# EAGLE schematic 01-main (EAGLE 9.6.2)

## Sheet 1 of 3
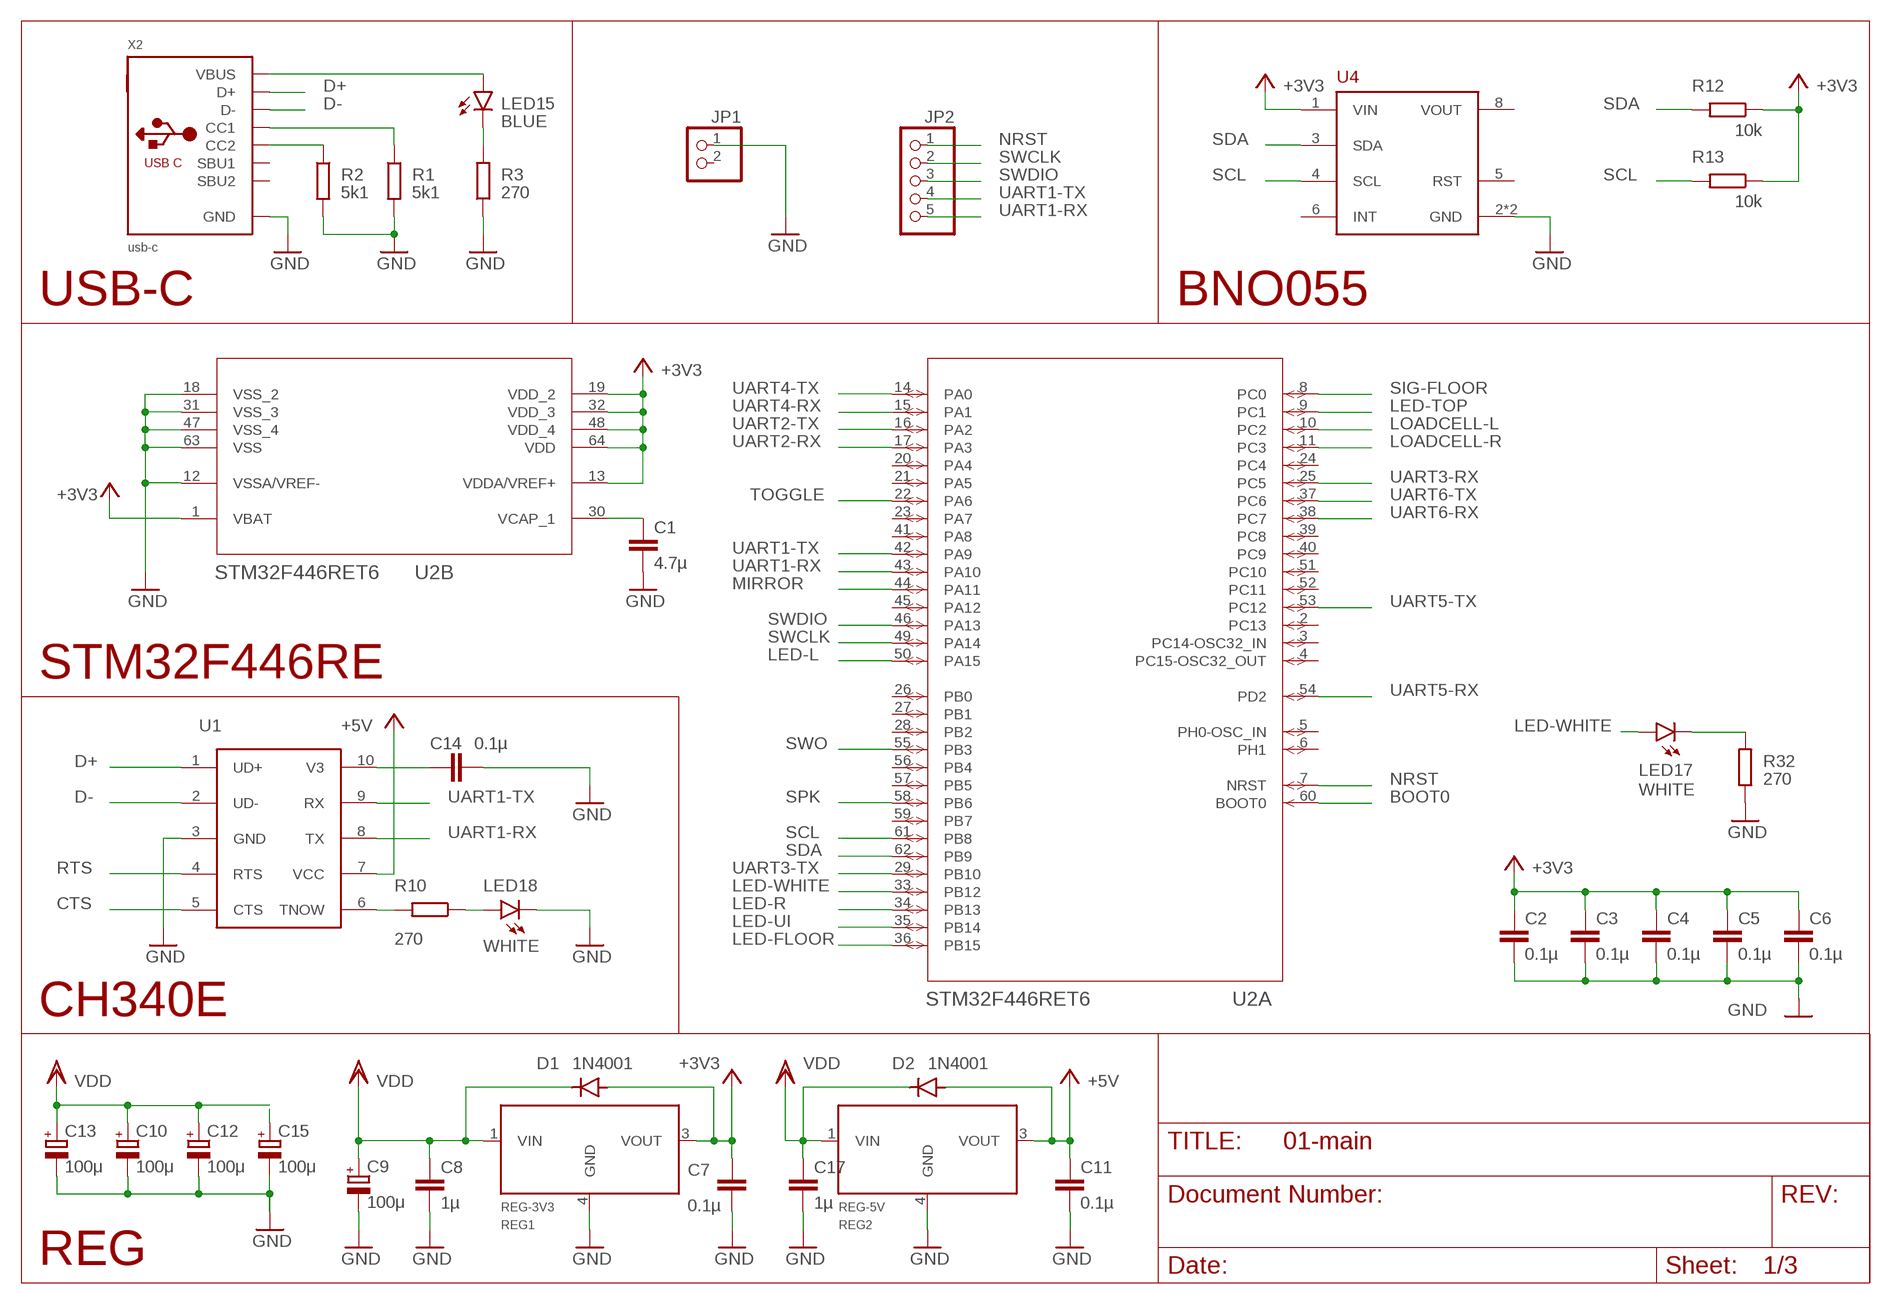
[diagram p0: schematic, sheet 1]

### Parts
C1  4.7µ  C-EUC0603  [C0603]
C2  0.1µ  C-EUC0603  [C0603]
C3  0.1µ  C-EUC0603  [C0603]
C4  0.1µ  C-EUC0603  [C0603]
C5  0.1µ  C-EUC0603  [C0603]
C6  0.1µ  C-EUC0603  [C0603]
C7  0.1µ  C-EUC0603  [C0603]
C8  1µ  C-EUC0603  [C0603]
C9  100μ  CPOL-EU153CLV-0505  [153CLV-0505]
C10  100μ  CPOL-EU153CLV-0505  [153CLV-0505]
C11  0.1µ  C-EUC0603  [C0603]
C12  100μ  CPOL-EU153CLV-0505  [153CLV-0505]
C13  100μ  CPOL-EU153CLV-0505  [153CLV-0505]
C14  0.1µ  C-EUC0603  [C0603]
C15  100μ  CPOL-EU153CLV-0505  [153CLV-0505]
C17  1µ  C-EUC0603  [C0603]
D1  1N4001  GF1  [SMA-DO214AC]
D2  1N4001  GF1  [SMA-DO214AC]
JP1  PINHD-1X2  [1X02]
JP2  PINHD-1X5  [1X05]
LED15  BLUE  LEDSML0603  [SML0603]
LED17  WHITE  LEDSML0603  [SML0603]
LED18  WHITE  LEDSML0603  [SML0603]
R1  5k1  R-EU_R0402  [R0402]
R2  5k1  R-EU_R0402  [R0402]
R3  270  R-EU_R0402  [R0402]
R10  270  R-EU_R0402  [R0402]
R12  10k  R-EU_R0402  [R0402]
R13  10k  R-EU_R0402  [R0402]
R32  270  R-EU_R0402  [R0402]
REG1  REG-3V3  MYPARTS_NJM7800S-REGULATOR  [MYPARTS_D-PAK_TO252AA]
REG2  REG-5V  MYPARTS_NJM7800S-REGULATOR  [MYPARTS_D-PAK_TO252AA]
U1  CH340ESMD  [MSOP10]
U2  STM32F446RET6  [LQFP64-10X10MM]
U4  BNO055  [SOCKET-08]
X2  usb-c  USB_C  [USB_C_CUSB31-CFM2AX-01-X]

### Nets
+3V3: C2.1 C3.1 C4.1 C5.1 C6.1 C7.1 D1.A R12.1 R13.1 REG1.3(VOUT) U2.1(B:VBAT) U2.13(B:VDDA/VREF+) U2.19(B:VDD_2) U2.32(B:VDD_3) U2.48(B:VDD_4) U2.64(B:VDD) U4.1(VIN) ; also sheet 3
+5V: C11.1 D2.A REG2.3(VOUT) U1.7(VCC) ; also sheet 2,3
BOOT0: U2.60(A:BOOT0) ; also sheet 3
CTS: U1.5(CTS)
D+: U1.1(UD+) X2.A6(D+) X2.B6(D+)
D-: U1.2(UD-) X2.A7(D-) X2.B7(D-)
GND: C1.2 C2.2 C3.2 C4.2 C5.2 C6.2 C7.2 C8.2 C9.- C10.- C11.2 C12.- C13.- C14.2 C15.- C17.2 JP1.1 LED18.C R1.2 R2.2 R3.1 R32.1 REG1.4(GND) REG2.4(GND) U1.3(GND) U2.12(B:VSSA/VREF-) U2.18(B:VSS_2) U2.31(B:VSS_3) U2.47(B:VSS_4) U2.63(B:VSS) U4.2(GND) U4.7(GND) X2.A1B12(GND) X2.B1A12(GND) ; also sheet 2,3
LED-FLOOR: U2.36(A:PB15) ; also sheet 3
LED-L: U2.50(A:PA15) ; also sheet 2
LED-R: U2.34(A:PB13) ; also sheet 2
LED-TOP: U2.9(A:PC1) ; also sheet 2
LED-UI: U2.35(A:PB14) ; also sheet 3
LED-WHITE: LED17.A U2.33(A:PB12)
LOADCELL-L: U2.10(A:PC2) ; also sheet 3
LOADCELL-R: U2.11(A:PC3) ; also sheet 3
MIRROR: U2.44(A:PA11) ; also sheet 3
N$8: C14.1 U1.10(V3)
N$14: R1.1 X2.A5(CC1)
N$15: R2.1 X2.B5(CC2)
N$16: LED15.C R3.2
N$18: C1.1 U2.30(B:VCAP_1)
N$22: R10.2 U1.6(TNOW)
N$23: LED18.A R10.1
N$32: LED17.C R32.2
N$49: LED15.A X2.A4B9(VBUS) X2.B4A9(VBUS)
NRST: JP2.1 U2.7(A:NRST) ; also sheet 3
RTS: U1.4(RTS)
SCL: R13.2 U2.61(A:PB8) U4.4(SCL)
SDA: R12.2 U2.62(A:PB9) U4.3(SDA)
SIG-FLOOR: U2.8(A:PC0) ; also sheet 3
SPK: U2.58(A:PB6) ; also sheet 3
SWCLK: JP2.2 U2.49(A:PA14)
SWDIO: JP2.3 U2.46(A:PA13)
SWO: U2.55(A:PB3)
TOGGLE: U2.22(A:PA6) ; also sheet 3
UART1-RX: JP2.5 U1.8(TX) U2.43(A:PA10)
UART1-TX: JP2.4 U1.9(RX) U2.42(A:PA9)
UART2-RX: U2.17(A:PA3) ; also sheet 2
UART2-TX: U2.16(A:PA2) ; also sheet 2
UART3-RX: U2.25(A:PC5) ; also sheet 3
UART3-TX: U2.29(A:PB10) ; also sheet 3
UART4-RX: U2.15(A:PA1) ; also sheet 2
UART4-TX: U2.14(A:PA0) ; also sheet 3
UART5-RX: U2.54(A:PD2) ; also sheet 2
UART5-TX: U2.53(A:PC12) ; also sheet 2
UART6-RX: U2.38(A:PC7) ; also sheet 2
UART6-TX: U2.37(A:PC6) ; also sheet 2
VDD: C8.1 C9.+ C10.+ C12.+ C13.+ C15.+ C17.1 D1.K(C) D2.K(C) REG1.1(VIN) REG2.1(VIN) ; also sheet 2,3
Unconnected: JP1.2 U2.2(A:PC13) U2.3(A:PC14-OSC32_IN) U2.4(A:PC15-OSC32_OUT) U2.5(A:PH0-OSC_IN) U2.6(A:PH1) U2.20(A:PA4) U2.21(A:PA5) U2.23(A:PA7) U2.24(A:PC4) U2.26(A:PB0) U2.27(A:PB1) U2.28(A:PB2) U2.39(A:PC8) U2.40(A:PC9) U2.41(A:PA8) U2.45(A:PA12) U2.51(A:PC10) U2.52(A:PC11) U2.56(A:PB4) U2.57(A:PB5) U2.59(A:PB7) U4.5(RST) U4.6(INT) X2.A8(SBU1) X2.B8(SBU2)

### Notes on the sheet
- USB-C | BNO055
- STM32F446RE
- CH340E
- REG

## Sheet 2 of 3
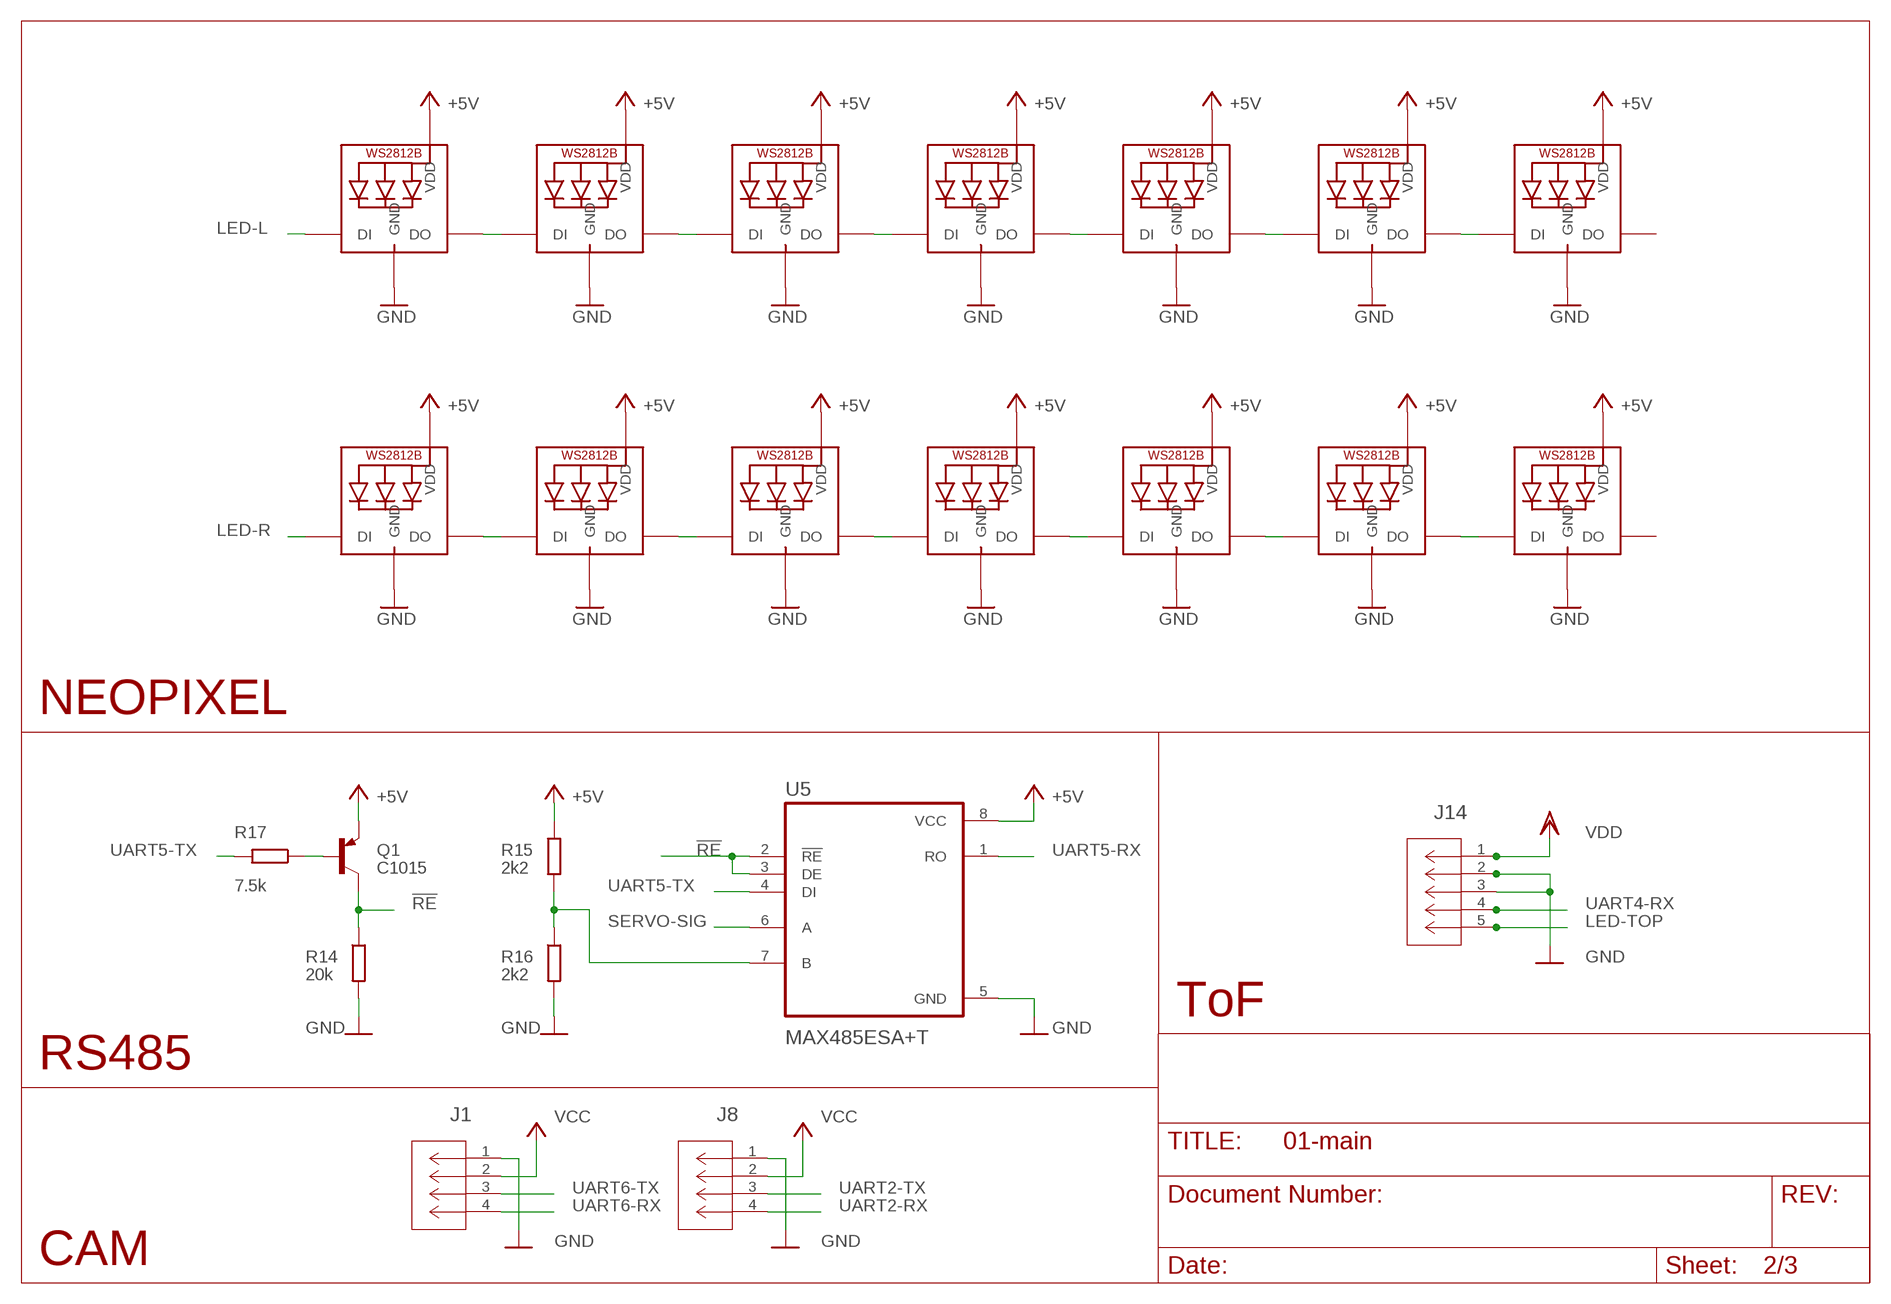
[diagram p1: schematic, sheet 2]

### Parts
J1  22057045  [CON_22057045_MOL]
J8  22057045  [CON_22057045_MOL]
J14  22057055  [CON_22057055_MOL]
LED1  WS2812B_2020  [WS2812B_2020]
LED2  WS2812B_2020  [WS2812B_2020]
LED3  WS2812B_2020  [WS2812B_2020]
LED4  WS2812B_2020  [WS2812B_2020]
LED5  WS2812B_2020  [WS2812B_2020]
LED6  WS2812B_2020  [WS2812B_2020]
LED7  WS2812B_2020  [WS2812B_2020]
LED8  WS2812B_2020  [WS2812B_2020]
LED9  WS2812B_2020  [WS2812B_2020]
LED10  WS2812B_2020  [WS2812B_2020]
LED11  WS2812B_2020  [WS2812B_2020]
LED12  WS2812B_2020  [WS2812B_2020]
LED13  WS2812B_2020  [WS2812B_2020]
LED14  WS2812B_2020  [WS2812B_2020]
Q1  C1015  BCX71SMD  [SOT23]
R14  20k  R-EU_R0402  [R0402]
R15  2k2  R-EU_R0402  [R0402]
R16  2k2  R-EU_R0402  [R0402]
R17  7.5k  R-EU_R0402  [R0402]
U5  MAX485ESA+T  [SOIC127P600X175-8N]

### Nets
!RE: Q1.3(C) R14.1 U5.2(!RE) U5.3(DE)
+5V: LED1.4(VDD) LED2.4(VDD) LED3.4(VDD) LED4.4(VDD) LED5.4(VDD) LED6.4(VDD) LED7.4(VDD) LED8.4(VDD) LED9.4(VDD) LED10.4(VDD) LED11.4(VDD) LED12.4(VDD) LED13.4(VDD) LED14.4(VDD) Q1.2(E) R15.1 U5.8(VCC) ; also sheet 1,3
GND: J1.1 J8.1 J14.2 J14.3 LED1.2(GND) LED2.2(GND) LED3.2(GND) LED4.2(GND) LED5.2(GND) LED6.2(GND) LED7.2(GND) LED8.2(GND) LED9.2(GND) LED10.2(GND) LED11.2(GND) LED12.2(GND) LED13.2(GND) LED14.2(GND) R14.2 R16.2 U5.5(GND) ; also sheet 1,3
LED-L: LED1.3(DI) ; also sheet 1
LED-R: LED8.3(DI) ; also sheet 1
LED-TOP: J14.5 ; also sheet 1
N$1: LED1.1(DO) LED2.3(DI)
N$2: LED2.1(DO) LED3.3(DI)
N$3: LED3.1(DO) LED4.3(DI)
N$4: LED4.1(DO) LED5.3(DI)
N$5: LED5.1(DO) LED6.3(DI)
N$6: LED6.1(DO) LED7.3(DI)
N$7: LED8.1(DO) LED9.3(DI)
N$9: LED9.1(DO) LED10.3(DI)
N$10: LED10.1(DO) LED11.3(DI)
N$11: LED11.1(DO) LED12.3(DI)
N$12: LED12.1(DO) LED13.3(DI)
N$13: LED13.1(DO) LED14.3(DI)
N$27: Q1.1(B) R17.1
N$28: R15.2 R16.1 U5.7(B)
SERVO-SIG: U5.6(A) ; also sheet 3
UART2-RX: J8.4 ; also sheet 1
UART2-TX: J8.3 ; also sheet 1
UART4-RX: J14.4 ; also sheet 1
UART5-RX: U5.1(RO) ; also sheet 1
UART5-TX: R17.2 U5.4(DI) ; also sheet 1
UART6-RX: J1.4 ; also sheet 1
UART6-TX: J1.3 ; also sheet 1
VCC: J1.2 J8.2 ; also sheet 3
VDD: J14.1 ; also sheet 1,3
Unconnected: LED7.1(DO) LED14.1(DO)

### Notes on the sheet
- NEOPIXEL
- ToF
- RS485
- CAM

## Sheet 3 of 3
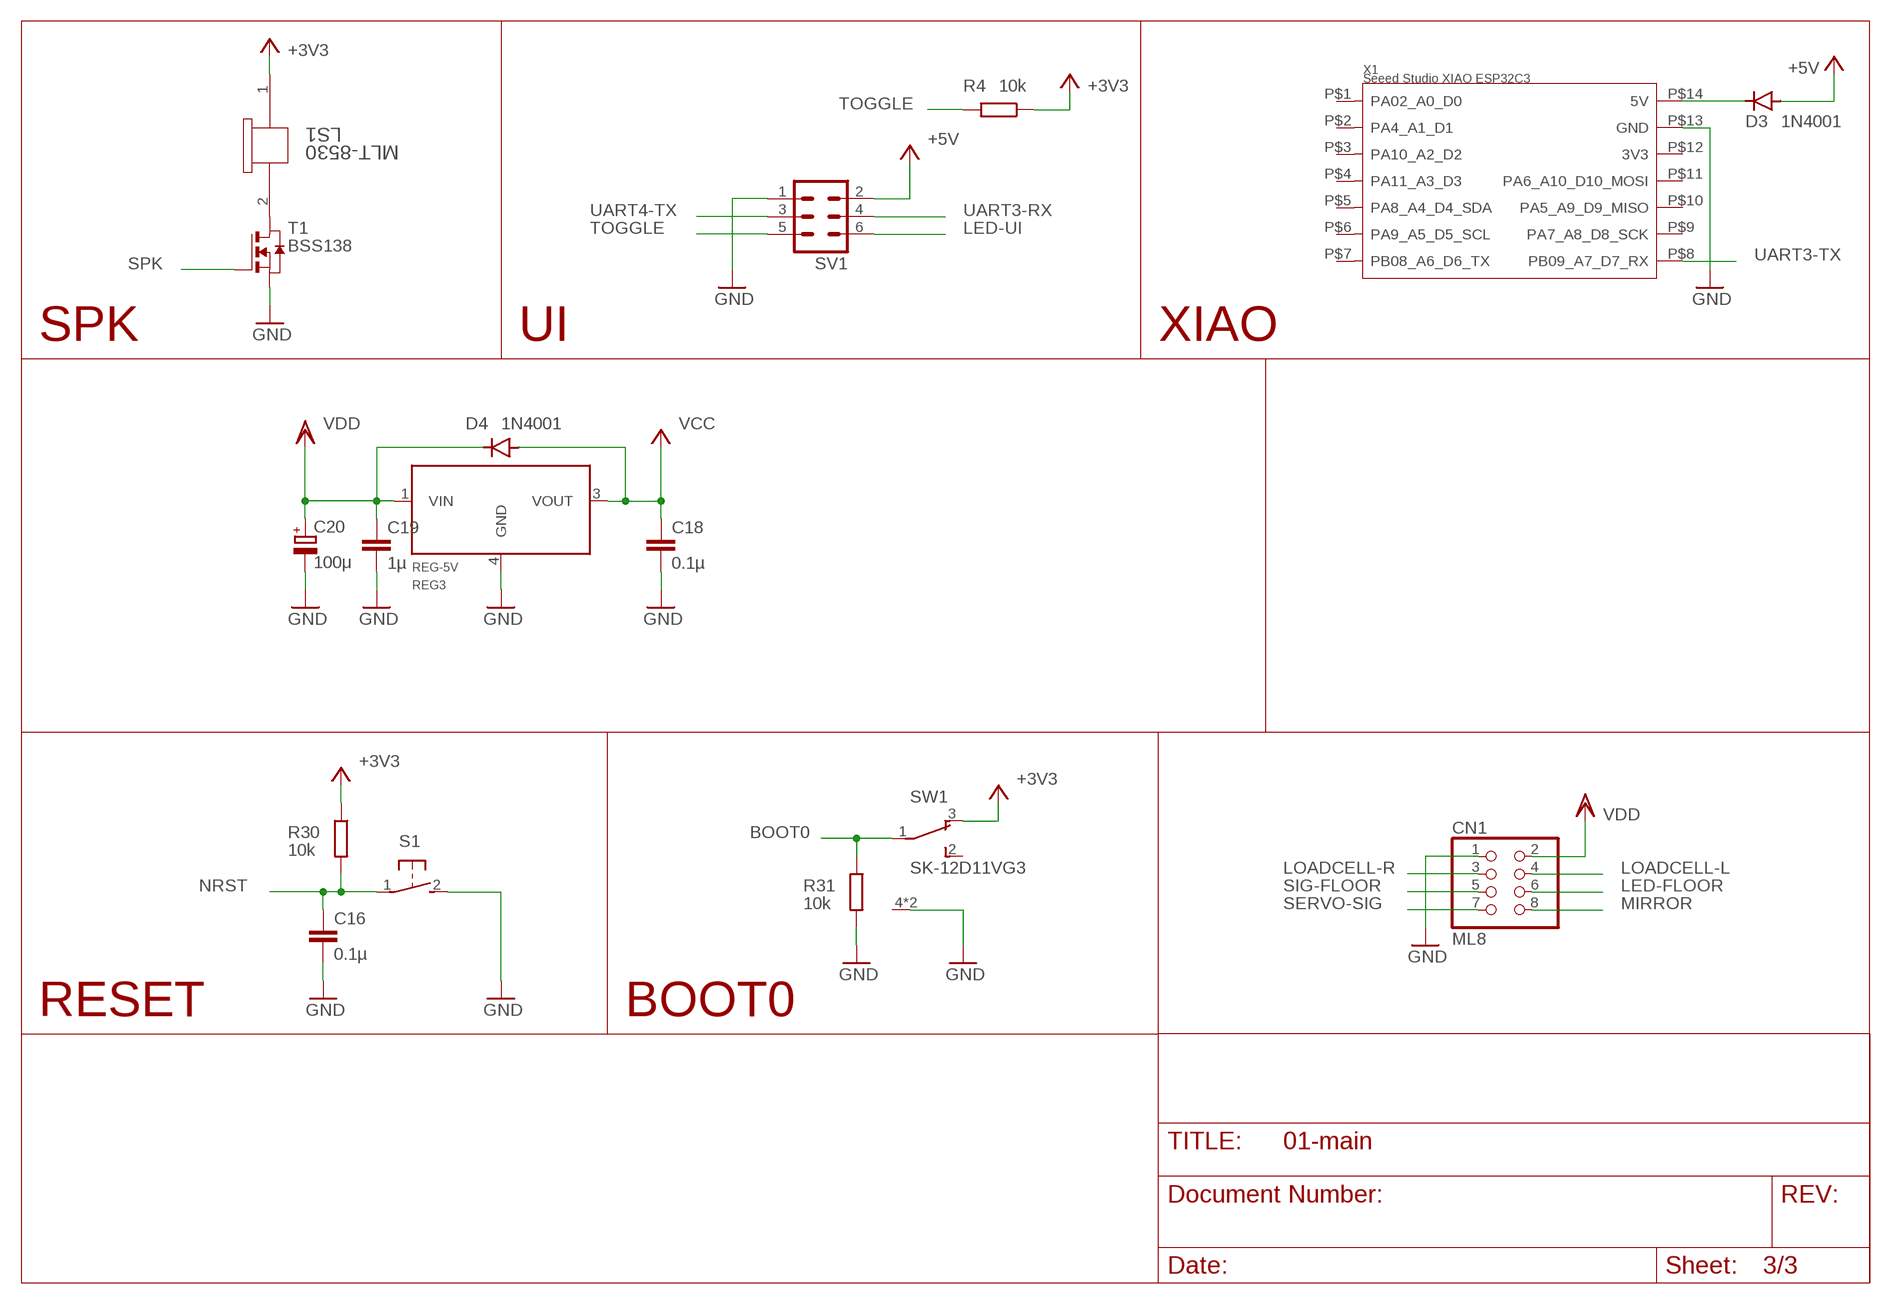
[diagram p2: schematic, sheet 3]

### Parts
C16  0.1µ  C-EUC0603  [C0603]
C18  0.1µ  C-EUC0603  [C0603]
C19  1µ  C-EUC0603  [C0603]
C20  100μ  CPOL-EU153CLV-0505  [153CLV-0505]
CN1  ML8  [ML6L]
D3  1N4001  GF1  [SMA-DO214AC]
D4  1N4001  GF1  [SMA-DO214AC]
LS1  MLT-8530  [MLT-8530_JHE]
R4  10k  R-EU_R0402  [R0402]
R30  10k  R-EU_R0402  [R0402]
R31  10k  R-EU_R0402  [R0402]
REG3  REG-5V  MYPARTS_NJM7800S-REGULATOR  [MYPARTS_D-PAK_TO252AA]
S1  31-XX  [B3F-31XX]
SV1  ML6L  [ML6L]
SW1  SK-12D11VG3  [SK-12D11VG3]
T1  BSS138  NMOSSOT23  [SOT-23]
X1  Seeed Studio XIAO ESP32C3  SEEEDUINO-XIAO-DIP  [XIAO-PINHEAD]

### Nets
+3V3: LS1.1 R4.1 R30.1 SW1.3(O) ; also sheet 1
+5V: D3.A SV1.2 ; also sheet 1,2
BOOT0: R31.1 SW1.1(P) ; also sheet 1
GND: C16.2 C18.2 C19.2 C20.- CN1.1 R31.2 REG3.4(GND) S1.2(S) SV1.1 SW1.4(CASE) SW1.5(CASE) T1.2(S) X1.P$13(GND) ; also sheet 1,2
LED-FLOOR: CN1.6 ; also sheet 1
LED-UI: SV1.6 ; also sheet 1
LOADCELL-L: CN1.4 ; also sheet 1
LOADCELL-R: CN1.3 ; also sheet 1
MIRROR: CN1.8 ; also sheet 1
N$17: LS1.2 T1.1(D)
N$31: D3.K(C) X1.P$14(5V)
NRST: C16.1 R30.2 S1.1(P) ; also sheet 1
SERVO-SIG: CN1.7 ; also sheet 2
SIG-FLOOR: CN1.5 ; also sheet 1
SPK: T1.3(G) ; also sheet 1
TOGGLE: R4.2 SV1.5 ; also sheet 1
UART3-RX: SV1.4 ; also sheet 1
UART3-TX: X1.P$8(PB09_A7_D7_RX) ; also sheet 1
UART4-TX: SV1.3 ; also sheet 1
VCC: C18.1 D4.A REG3.3(VOUT) ; also sheet 2
VDD: C19.1 C20.+ CN1.2 D4.K(C) REG3.1(VIN) ; also sheet 1,2
Unconnected: SW1.2(S) X1.P$1(PA02_A0_D0) X1.P$2(PA4_A1_D1) X1.P$3(PA10_A2_D2) X1.P$4(PA11_A3_D3) X1.P$5(PA8_A4_D4_SDA) X1.P$6(PA9_A5_D5_SCL) X1.P$7(PB08_A6_D6_TX) X1.P$9(PA7_A8_D8_SCK) X1.P$10(PA5_A9_D9_MISO) X1.P$11(PA6_A10_D10_MOSI) X1.P$12(3V3)

### Notes on the sheet
- SPK | UI | XIAO
- RESET | BOOT0

## Power pins joined to a net without a drawn wire
VOUT: U4.8(VOUT)

## Library data of the parts
C1-C8 C11 C14 C16-C19 = rcl:C-EU: CAPACITOR, European symbol; SPICEPREFIX: C
C9 C10 C12 C13 C15 C20 = rcl:CPOL-EU: POLARIZED CAPACITOR, European symbol; SPICEPREFIX: C
CN1 = ML8:ML8
D1-D4 = diode:GF1: DIODE
J1 J8 = con-molex-5268:22057045; COPYRIGHT: Copyright (C) 2022 Ultra Librarian. All rights reserved.; MANUFACTURER_PART_NUMBER: 22057045; MFR_NAME: Molex Connector Corporation
J14 = con-molex-5268:22057055; COPYRIGHT: Copyright (C) 2022 Ultra Librarian. All rights reserved.; MANUFACTURER_PART_NUMBER: 22057055; MFR_NAME: Molex Connector Corporation
JP1 = pinhead-compact:PINHD-1X2: PIN HEADER
JP2 = pinhead-compact:PINHD-1X5: PIN HEADER
LED1-LED14 = microbuilder:WS2812B
LED15 LED17 LED18 = led:LED: LED OSRAM: - CHIPLED LG R971, LG N971, LY N971, LG Q971, LY Q971, LO R971, LY R971 LH N974, LH R974 LS Q976, LO Q976, LY Q976 LO Q996 - Hyper CHIPLED LW Q18S LB Q993, LB Q99A, LB R99A - SideLED LS A670, LO A670, LY A670, LG A670, LP A670 LB A673, LV A673, LT A673, LW A673 LH A674 LY A675 LS A676, LA A676, LO A676, LY A676, LW A676 LS A679, LY A679, LG A679 - Hyper Micro SIDELED® LS Y876, LA Y876, LO Y876, LY Y876 LT Y87S - SmartLED LW L88C, LW L88S LB L89C, LB L89S, LG L890 LS L89K, LO L89K, LY L89K LS L896, LA L896, LO L896, LY L896 - TOPLED LS T670, LO T670, LY T670, LG T670, LP T670 LSG T670, LSP T670, LSY T670, LOP T670, LYG T670 LG T671, LOG T671, LSG T671 LB T673, LV T673, LT T673, LW T673 LH T674 LS T676, LA T676, LO T676, LY T676, LB T676, LH T676, LSB T676, LW T676 LB T67C, LV T67C, LT T67C, LS T67K, LO T67K, LY T67K, LW E67C LS E67B, LA E67B, LO E67B, LY E67B, LB E67C, LV E67C, LT E67C LW T67C LS T679, LY T679, LG T679 LS T770, LO T770, LY T770, LG T770, LP T770 LB T773, LV T773, LT T773, LW T773 LH T774 LS E675, LA E675, LY E675, LS T675 LS T776, LA T776, LO T776, LY T776, LB T776 LHGB T686 LT T68C, LB T68C - Hyper Mini TOPLED® LB M676 - Mini TOPLED Santana® LG M470 LS M47K, LO M47K, LY M47K Source: http://www.osram.convergy.de LUXEON: - LUMILED® LXK2-PW12-R00, LXK2-PW12-S00, LXK2-PW14-U00, LXK2-PW14-V00 LXK2-PM12-R00, LXK2-PM12-S00, LXK2-PM14-U00 LXK2-PE12-Q00, LXK2-PE12-R00, LXK2-PE12-S00, LXK2-PE14-T00, LXK2-PE14-U00 LXK2-PB12-K00, LXK2-PB12-L00, LXK2-PB12-M00, LXK2-PB14-N00, LXK2-PB14-P00, LXK2-PB14-Q00 LXK2-PR12-L00, LXK2-PR12-M00, LXK2-PR14-Q00, LXK2-PR14-R00 LXK2-PD12-Q00, LXK2-PD12-R00, LXK2-PD12-S00 LXK2-PH12-R00, LXK2-PH12-S00 LXK2-PL12-P00, LXK2-PL12-Q00, LXK2-PL12-R00 Source: www.luxeon.com KINGBRIGHT: KA-3528ASYC Source: www.kingbright.com
LS1 = MLT-8530:MLT-8530; COPYRIGHT: Copyright (C) 2022 Ultra Librarian. All rights reserved.; MANUFACTURER_PART_NUMBER: MLT-8530; MFR_NAME: Jiangsu Huaneng Elec
Q1 = transistor-pnp:BCX71SMD: PNP Transistor
R1-R4 R10 R12-R17 R30-R32 = rcl:R-EU_: RESISTOR, European symbol; SPICEPREFIX: R
REG1-REG3 = #001-line:MYPARTS_NJM7800S-REGULATOR
S1 = switch-omron:31-XX: OMRON SWITCH; MPN: B3F-3100; OC_FARNELL: 959704; OC_NEWARK: 36M3582
SV1 = con-ml:ML6L: HARTING; OC_FARNELL: unknown; OC_NEWARK: unknown
SW1 = Slide Switch:SK-12D11VG3
T1 = zetex:NMOSSOT23: MOS FET; OC_FARNELL: unknown; OC_NEWARK: unknown
U1 = CH340E:CH340E: WCH.CN/CH340E See DataSheet： wch.cn <http://www.wch.cn/downloads/CH340DS1_PDF.html>
U2 = F446RE:STM32F446RET6; COPYRIGHT: Copyright (C) 2022 Ultra Librarian. All rights reserved.; MANUFACTURER_PART_NUMBER: STM32F446RET6; MFR_NAME: STMicroelectronics
U4 = BNO055:BNO055
U5 = MAX485:MAX485ESA+T: Check availability <https://pricing.snapeda.com/parts/MAX485ESA/Maxim%20Integrated/view-part?ref=eda>; AVAILABILITY: In Stock; DESCRIPTION: 1/1 Transceiver Half RS422, RS485 8-SOIC; MF: Maxim Integrated; MP: MAX485ESA; PACKAGE: SOIC-8 Maxim; PRICE: None; PURCHASE-URL: https://pricing.snapeda.com/search/part/MAX485ESA/?ref=eda
X1 = Seeeduino XIAO:SEEEDUINO-XIAO-DIP
X2 = microbuilder:USB_C: USB Type-C USB 2.0 Connector

## Net classes
0 default: width 0.254 mm